# EAGLE schematic Schaltplan V1.0 (EAGLE 9.6.2)
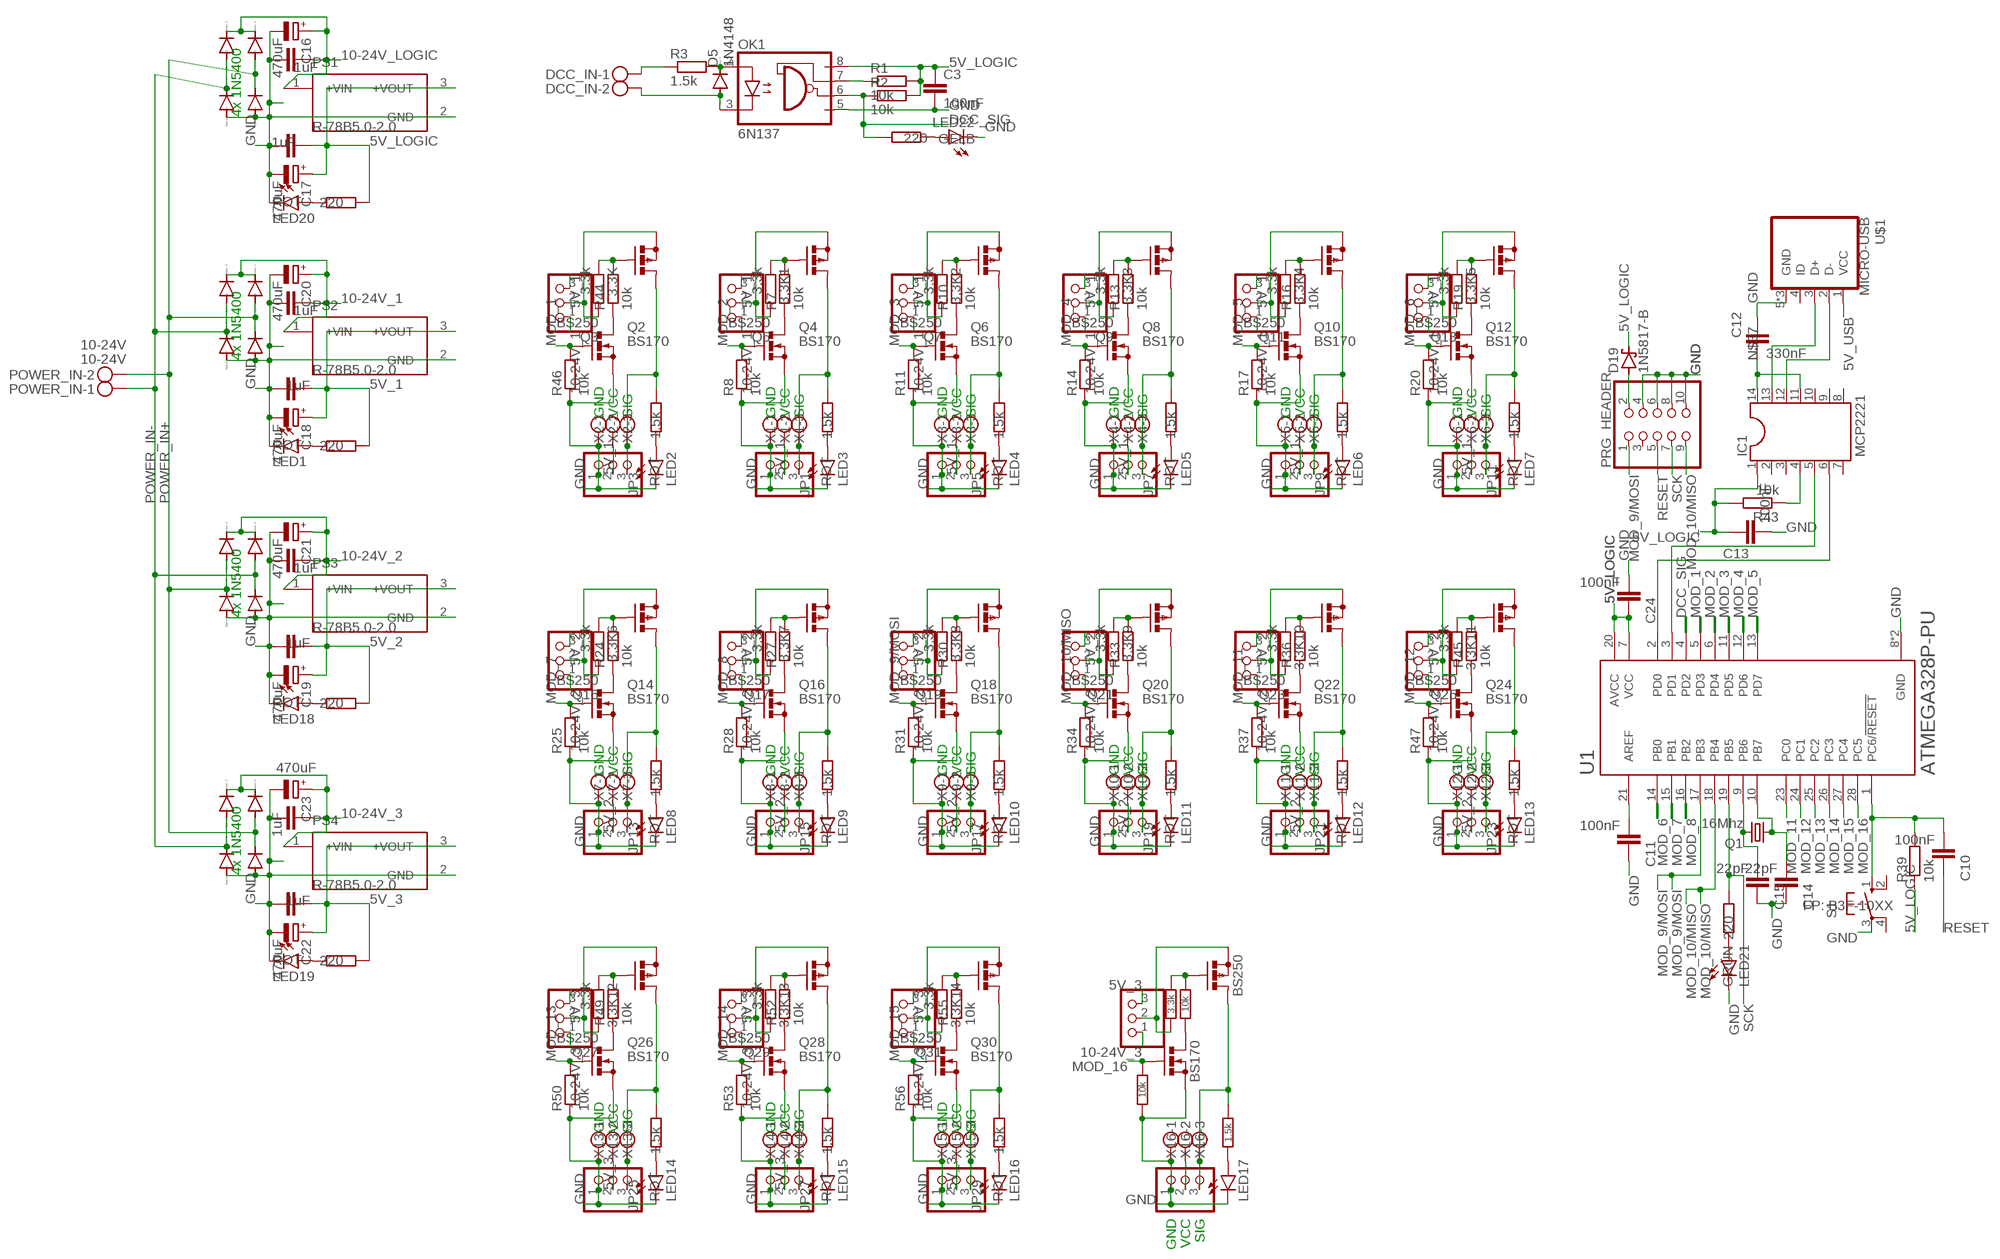
[diagram p0: schematic, sheet 1]

## Parts
3,3K  3.3k  R-EU_0207/7  [0207/7]
3,3K1  3.3k  R-EU_0207/7  [0207/7]
3,3K2  3.3k  R-EU_0207/7  [0207/7]
3,3K3  3.3k  R-EU_0207/7  [0207/7]
3,3K4  3.3k  R-EU_0207/7  [0207/7]
3,3K5  3.3k  R-EU_0207/7  [0207/7]
3,3K6  3.3k  R-EU_0207/7  [0207/7]
3,3K7  3.3k  R-EU_0207/7  [0207/7]
3,3K8  3.3k  R-EU_0207/7  [0207/7]
3,3K9  3.3k  R-EU_0207/7  [0207/7]
3,3K10  3.3k  R-EU_0207/7  [0207/7]
3,3K11  3.3k  R-EU_0207/7  [0207/7]
3,3K12  3.3k  R-EU_0207/7  [0207/7]
3,3K13  3.3k  R-EU_0207/7  [0207/7]
3,3K14  3.3k  R-EU_0207/7  [0207/7]
3,3K15  3.3k  R-EU_0207/7  [0207/7]
C1  1uF  C-EU050-025X075  [C050-025X075]
C2  1uF  C-EU050-025X075  [C050-025X075]
C3  100nF  C-EU025-025X050  [C025-025X050]
C4  1uF  C-EU050-025X075  [C050-025X075]
C5  1uF  C-EU050-025X075  [C050-025X075]
C6  1uF  C-EU050-025X075  [C050-025X075]
C7  1uF  C-EU050-025X075  [C050-025X075]
C8  1uF  C-EU050-025X075  [C050-025X075]
C9  1uF  C-EU050-025X075  [C050-025X075]
C10  100nF  C-EU025-025X050  [C025-025X050]
C11  100nF  C-EU025-025X050  [C025-025X050]
C12  330nF  C-EU025-025X050  [C025-025X050]
C13  100nF  C-EU025-025X050  [C025-025X050]
C14  22pF  C-EU025-030X050  [C025-030X050]
C15  22pF  C-EU025-030X050  [C025-030X050]
C16  470uF  CPOL-EUE5-10.5  [E5-10,5]
C17  470uF  CPOL-EUE5-10.5  [E5-10,5]
C18  470uF  CPOL-EUE5-10.5  [E5-10,5]
C19  470uF  CPOL-EUE5-10.5  [E5-10,5]
C20  470uF  CPOL-EUE5-10.5  [E5-10,5]
C21  470uF  CPOL-EUE5-10.5  [E5-10,5]
C22  470uF  CPOL-EUE5-10.5  [E5-10,5]
C23  470uF  CPOL-EUE5-10.5  [E5-10,5]
C24  100nF  C-EU025-025X050  [C025-025X050]
D1  1N5400  [DO201-15]
D2  1N5400  [DO201-15]
D3  1N5400  [DO201-15]
D4  1N5400  [DO201-15]
D5  1N4148  1N4148DO35-7  [DO35-7]
D6  1N5400  [DO201-15]
D7  1N5400  [DO201-15]
D8  1N5400  [DO201-15]
D9  1N5400  [DO201-15]
D10  1N5400  [DO201-15]
D11  1N5400  [DO201-15]
D12  1N5400  [DO201-15]
D13  1N5400  [DO201-15]
D14  1N5400  [DO201-15]
D15  1N5400  [DO201-15]
D16  1N5400  [DO201-15]
D17  1N5400  [DO201-15]
D19  1N5817-B  [DO41-7.6]
DCC_IN  MKDSN1,5/2-5,08  [MKDSN1,5/2-5,08]
IC1  MCP2221  DIL14  [DIL14]
JP1  PINHD-1X3  [1X03]
JP2  PINHD-1X3  [1X03]
JP3  PINHD-1X3  [1X03]
JP4  PINHD-1X3  [1X03]
JP5  PINHD-1X3  [1X03]
JP6  PINHD-1X3  [1X03]
JP7  PINHD-1X3  [1X03]
JP8  PINHD-1X3  [1X03]
JP9  PINHD-1X3  [1X03]
JP10  PINHD-1X3  [1X03]
JP11  PINHD-1X3  [1X03]
JP12  PINHD-1X3  [1X03]
JP13  PINHD-1X3  [1X03]
JP14  PINHD-1X3  [1X03]
JP15  PINHD-1X3  [1X03]
JP16  PINHD-1X3  [1X03]
JP17  PINHD-1X3  [1X03]
JP18  PINHD-1X3  [1X03]
JP19  PINHD-1X3  [1X03]
JP20  PINHD-1X3  [1X03]
JP21  PINHD-1X3  [1X03]
JP22  PINHD-1X3  [1X03]
JP23  PINHD-1X3  [1X03]
JP24  PINHD-1X3  [1X03]
JP25  PINHD-1X3  [1X03]
JP26  PINHD-1X3  [1X03]
JP27  PINHD-1X3  [1X03]
JP28  PINHD-1X3  [1X03]
JP29  PINHD-1X3  [1X03]
JP30  PINHD-1X3  [1X03]
JP31  PINHD-1X3  [1X03]
JP32  PINHD-1X3  [1X03]
LED1  ROT  LED3MM  [LED3MM]
LED2  ROT  LED3MM  [LED3MM]
LED3  ROT  LED3MM  [LED3MM]
LED4  ROT  LED3MM  [LED3MM]
LED5  ROT  LED3MM  [LED3MM]
LED6  ROT  LED3MM  [LED3MM]
LED7  ROT  LED3MM  [LED3MM]
LED8  ROT  LED3MM  [LED3MM]
LED9  ROT  LED3MM  [LED3MM]
LED10  ROT  LED3MM  [LED3MM]
LED11  ROT  LED3MM  [LED3MM]
LED12  ROT  LED3MM  [LED3MM]
LED13  ROT  LED3MM  [LED3MM]
LED14  ROT  LED3MM  [LED3MM]
LED15  ROT  LED3MM  [LED3MM]
LED16  ROT  LED3MM  [LED3MM]
LED17  ROT  LED3MM  [LED3MM]
LED18  ROT  LED3MM  [LED3MM]
LED19  ROT  LED3MM  [LED3MM]
LED20  ROT  LED3MM  [LED3MM]
LED21  GRÜN  LED3MM  [LED3MM]
LED22  GELB  LED3MM  [LED3MM]
OK1  6N137  [DIL08]
POWER_IN  10-24V  MKDSN1,5/2-5,08  [MKDSN1,5/2-5,08]
PRG_HEADER  PINHD-2X5  [2X05]
PS1  R-78B5.0-2.0  [CONV_R-78B5.0-2.0]
PS2  R-78B5.0-2.0  [CONV_R-78B5.0-2.0]
PS3  R-78B5.0-2.0  [CONV_R-78B5.0-2.0]
PS4  R-78B5.0-2.0  [CONV_R-78B5.0-2.0]
Q1  16Mhz  CRYSTALHC49U-V  [HC49U-V]
Q2  BS170  [SOT54E]
Q3  BS250  [SOT54E]
Q4  BS170  [SOT54E]
Q5  BS250  [SOT54E]
Q6  BS170  [SOT54E]
Q7  BS250  [SOT54E]
Q8  BS170  [SOT54E]
Q9  BS250  [SOT54E]
Q10  BS170  [SOT54E]
Q11  BS250  [SOT54E]
Q12  BS170  [SOT54E]
Q13  BS250  [SOT54E]
Q14  BS170  [SOT54E]
Q15  BS250  [SOT54E]
Q16  BS170  [SOT54E]
Q17  BS250  [SOT54E]
Q18  BS170  [SOT54E]
Q19  BS250  [SOT54E]
Q20  BS170  [SOT54E]
Q21  BS250  [SOT54E]
Q22  BS170  [SOT54E]
Q23  BS250  [SOT54E]
Q24  BS170  [SOT54E]
Q25  BS250  [SOT54E]
Q26  BS170  [SOT54E]
Q27  BS250  [SOT54E]
Q28  BS170  [SOT54E]
Q29  BS250  [SOT54E]
Q30  BS170  [SOT54E]
Q31  BS250  [SOT54E]
Q32  BS170  [SOT54E]
Q33  BS250  [SOT54E]
R1  10k  R-EU_0207/7  [0207/7]
R2  10k  R-EU_0207/7  [0207/7]
R3  1.5k  R-EU_0207/7  [0207/7]
R4  220  R-EU_0207/7  [0207/7]
R5  1.5k  R-EU_0207/7  [0207/7]
R6  1.5k  R-EU_0207/7  [0207/7]
R7  10k  R-EU_0207/7  [0207/7]
R8  10k  R-EU_0207/7  [0207/7]
R9  1.5k  R-EU_0207/7  [0207/7]
R10  10k  R-EU_0207/7  [0207/7]
R11  10k  R-EU_0207/7  [0207/7]
R12  1.5k  R-EU_0207/7  [0207/7]
R13  10k  R-EU_0207/7  [0207/7]
R14  10k  R-EU_0207/7  [0207/7]
R15  1.5k  R-EU_0207/7  [0207/7]
R16  10k  R-EU_0207/7  [0207/7]
R17  10k  R-EU_0207/7  [0207/7]
R18  1.5k  R-EU_0207/7  [0207/7]
R19  10k  R-EU_0207/7  [0207/7]
R20  10k  R-EU_0207/7  [0207/7]
R21  220  R-EU_0207/7  [0207/7]
R22  220  R-EU_0207/7  [0207/7]
R23  1.5k  R-EU_0207/7  [0207/7]
R24  10k  R-EU_0207/7  [0207/7]
R25  10k  R-EU_0207/7  [0207/7]
R26  1.5k  R-EU_0207/7  [0207/7]
R27  10k  R-EU_0207/7  [0207/7]
R28  10k  R-EU_0207/7  [0207/7]
R29  1.5k  R-EU_0207/7  [0207/7]
R30  10k  R-EU_0207/7  [0207/7]
R31  10k  R-EU_0207/7  [0207/7]
R32  1.5k  R-EU_0207/7  [0207/7]
R33  10k  R-EU_0207/7  [0207/7]
R34  10k  R-EU_0207/7  [0207/7]
R35  1.5k  R-EU_0207/7  [0207/7]
R36  10k  R-EU_0207/7  [0207/7]
R37  10k  R-EU_0207/7  [0207/7]
R38  1.5k  R-EU_0207/7  [0207/7]
R39  10k  R-EU_0207/7  [0207/7]
R40  220  R-EU_0207/7  [0207/7]
R41  220  R-EU_0207/7  [0207/7]
R42  220  R-EU_0207/7  [0207/7]
R43  10k  R-EU_0207/7  [0207/7]
R44  10k  R-EU_0207/7  [0207/7]
R45  10k  R-EU_0207/7  [0207/7]
R46  10k  R-EU_0207/7  [0207/7]
R47  10k  R-EU_0207/7  [0207/7]
R48  1.5k  R-EU_0207/7  [0207/7]
R49  10k  R-EU_0207/7  [0207/7]
R50  10k  R-EU_0207/7  [0207/7]
R51  1.5k  R-EU_0207/7  [0207/7]
R52  10k  R-EU_0207/7  [0207/7]
R53  10k  R-EU_0207/7  [0207/7]
R54  1.5k  R-EU_0207/7  [0207/7]
R55  10k  R-EU_0207/7  [0207/7]
R56  10k  R-EU_0207/7  [0207/7]
R57  1.5k  R-EU_0207/7  [0207/7]
R58  10k  R-EU_0207/7  [0207/7]
R59  10k  R-EU_0207/7  [0207/7]
S1  FP: B3F-10XX  10-XX  [B3F-10XX]
U1  ATMEGA328P-PU  [DIP794W46P254L2967H457Q28B]
U$1  MICRO-USB  [MICRO-USB]
X1  MKDSN1,5/3-5,08  [MKDSN1,5/3-5,08]
X2  MKDSN1,5/3-5,08  [MKDSN1,5/3-5,08]
X3  MKDSN1,5/3-5,08  [MKDSN1,5/3-5,08]
X4  MKDSN1,5/3-5,08  [MKDSN1,5/3-5,08]
X5  MKDSN1,5/3-5,08  [MKDSN1,5/3-5,08]
X6  MKDSN1,5/3-5,08  [MKDSN1,5/3-5,08]
X7  MKDSN1,5/3-5,08  [MKDSN1,5/3-5,08]
X8  MKDSN1,5/3-5,08  [MKDSN1,5/3-5,08]
X9  MKDSN1,5/3-5,08  [MKDSN1,5/3-5,08]
X10  MKDSN1,5/3-5,08  [MKDSN1,5/3-5,08]
X11  MKDSN1,5/3-5,08  [MKDSN1,5/3-5,08]
X12  MKDSN1,5/3-5,08  [MKDSN1,5/3-5,08]
X13  MKDSN1,5/3-5,08  [MKDSN1,5/3-5,08]
X14  MKDSN1,5/3-5,08  [MKDSN1,5/3-5,08]
X15  MKDSN1,5/3-5,08  [MKDSN1,5/3-5,08]
X16  MKDSN1,5/3-5,08  [MKDSN1,5/3-5,08]

## Nets
5V_1: C1.2 C18.+ JP1.2 JP2.3 JP3.2 JP4.3 JP5.2 JP6.3 JP7.2 JP8.3 JP9.2 JP10.3 JP11.2 JP12.3 PS2.3(+VOUT) R4.2 X1.2 X2.2 X3.2 X4.2 X5.2 X6.2
5V_2: C4.2 C19.+ JP13.2 JP14.3 JP15.2 JP16.3 JP17.2 JP18.3 JP19.2 JP20.3 JP21.2 JP22.3 JP23.2 JP24.3 PS3.3(+VOUT) R21.2 X7.2 X8.2 X9.2 X10.2 X11.2 X12.2
5V_3: C6.2 C22.+ JP25.2 JP26.3 JP27.2 JP28.3 JP29.2 JP30.3 JP31.2 JP32.3 PS4.3(+VOUT) R22.2 X13.2 X14.2 X15.2 X16.2
5V_LOGIC: C3.1 C8.2 C13.1 C17.+ C24.1 D19.C IC1.1 OK1.8(VCC) PS1.3(+VOUT) R1.2 R2.2 R39.1 R40.2 R43.2 U1.7(VCC) U1.20(AVCC)
5V_USB: U$1.1(VCC)
10-24V_1: C2.2 C20.+ D1.C D3.C JP2.1 JP4.1 JP6.1 JP8.1 JP10.1 JP12.1 PS2.1(+VIN)
10-24V_2: C5.2 C21.+ D6.C D8.C JP14.1 JP16.1 JP18.1 JP20.1 JP22.1 JP24.1 PS3.1(+VIN)
10-24V_3: C7.2 C23.+ D10.C D12.C JP26.1 JP28.1 JP30.1 JP32.1 PS4.1(+VIN)
10-24V_LOGIC: C9.2 C16.+ D14.C D16.C PS1.1(+VIN)
AREF: C11.2 U1.21(AREF)
DCC_SIG: OK1.6(VO) R2.1 R42.2 U1.4(PD2)
GND: C1.1 C2.1 C3.2 C4.1 C5.1 C6.1 C7.1 C8.1 C9.1 C11.1 C12.1 C13.2 C14.1 C15.1 C16.- C17.- C18.- C19.- C20.- C21.- C22.- C23.- C24.2 D2.A D4.A D7.A D9.A D11.A D13.A D15.A D17.A JP1.1 JP3.1 JP5.1 JP7.1 JP9.1 JP11.1 JP13.1 JP15.1 JP17.1 JP19.1 JP21.1 JP23.1 JP25.1 JP27.1 JP29.1 JP31.1 LED1.K(C) LED2.K(C) LED3.K(C) LED4.K(C) LED5.K(C) LED6.K(C) LED7.K(C) LED8.K(C) LED9.K(C) LED10.K(C) LED11.K(C) LED12.K(C) LED13.K(C) LED14.K(C) LED15.K(C) LED16.K(C) LED17.K(C) LED18.K(C) LED19.K(C) LED20.K(C) LED21.K(C) LED22.K(C) OK1.5(GND) PRG_HEADER.4 PRG_HEADER.6 PRG_HEADER.8 PRG_HEADER.10 PS1.2(GND) PS2.2(GND) PS3.2(GND) PS4.2(GND) Q2.S Q4.S Q6.S Q8.S Q10.S Q12.S Q14.S Q16.S Q18.S Q20.S Q22.S Q24.S Q26.S Q28.S Q30.S Q32.S R8.1 R11.1 R14.1 R17.1 R20.1 R25.1 R28.1 R31.1 R34.1 R37.1 R46.1 R47.1 R50.1 R53.1 R56.1 R59.1 S1.3(P) U1.8(GND) U1.22(GND) U$1.5(GND) U$1.GND1(GND) U$1.GND2(GND) X1.1 X2.1 X3.1 X4.1 X5.1 X6.1 X7.1 X8.1 X9.1 X10.1 X11.1 X12.1 X13.1 X14.1 X15.1 X16.1
MOD_1: Q2.G R46.2 U1.5(PD3)
MOD_2: Q4.G R8.2 U1.6(PD4)
MOD_3: Q6.G R11.2 U1.11(PD5)
MOD_4: Q8.G R14.2 U1.12(PD6)
MOD_5: Q10.G R17.2 U1.13(PD7)
MOD_6: Q12.G R20.2 U1.14(PB0)
MOD_7: Q14.G R25.2 U1.15(PB1)
MOD_8: Q16.G R28.2 U1.16(PB2)
MOD_9/MOSI: PRG_HEADER.1 Q18.G R31.2 U1.17(PB3)
MOD_10/MISO: PRG_HEADER.9 Q20.G R34.2 U1.18(PB4)
MOD_11: Q22.G R37.2 U1.23(PC0)
MOD_12: Q24.G R47.2 U1.24(PC1)
MOD_13: Q26.G R50.2 U1.25(PC2)
MOD_14: Q28.G R53.2 U1.26(PC3)
MOD_15: Q30.G R56.2 U1.27(PC4)
MOD_16: Q32.G R59.2 U1.28(PC5)
N$1: DCC_IN.1 R3.1
N$2: LED1.A R4.1
N$3: LED18.A R21.1
N$4: D5.C OK1.2(A) R3.2
N$5: JP3.3 Q3.D R5.2 X2.3
N$6: JP1.3 Q5.D R6.2 X1.3
N$7: LED19.A R22.1
N$8: OK1.7(VE) R1.1
N$10: 3,3K13.1 Q29.G R52.2
N$13: LED20.A R40.1
N$14: LED3.A R6.1
N$15: 3,3K.2 JP4.2 Q3.S
N$16: LED2.A R5.1
N$17: LED21.A R41.1
N$18: 3,3K12.1 Q27.G R49.2
N$19: Q4.D R7.1
N$20: LED22.A R42.1
N$21: 3,3K1.2 JP2.2 Q5.S
N$22: JP5.3 Q7.D R9.2 X3.3
N$23: LED4.A R9.1
N$24: IC1.5 U1.3(PD1)
N$25: Q2.D R44.1
N$26: IC1.4 R43.1
N$27: IC1.13 U$1.3(D+)
N$28: 3,3K14.1 Q31.G R55.2
N$29: Q6.D R10.1
N$30: 3,3K2.2 JP6.2 Q7.S
N$31: JP7.3 Q9.D R12.2 X4.3
N$32: IC1.6 U1.2(PD0)
N$33: IC1.12 U$1.2(D-)
N$34: LED5.A R12.1
N$35: 3,3K15.1 Q33.G R58.2
N$36: Q8.D R13.1
N$37: C12.2 IC1.11 IC1.14
N$38: D19.A PRG_HEADER.2
N$39: 3,3K3.2 JP8.2 Q9.S
N$40: JP9.3 Q11.D R15.2 X5.3
N$41: LED6.A R15.1
N$43: Q10.D R16.1
N$44: 3,3K4.2 JP10.2 Q11.S
N$45: JP11.3 Q13.D R18.2 X6.3
N$46: LED7.A R18.1
N$48: Q12.D R19.1
N$49: D5.A DCC_IN.2 OK1.3(C)
N$50: 3,3K5.2 JP12.2 Q13.S
N$51: JP13.3 Q15.D R23.2 X7.3
N$52: LED8.A R23.1
N$53: 3,3K5.1 Q13.G R19.2
N$54: Q14.D R24.1
N$55: 3,3K6.2 JP14.2 Q15.S
N$56: JP15.3 Q17.D R26.2 X8.3
N$57: LED9.A R26.1
N$58: 3,3K4.1 Q11.G R16.2
N$59: Q16.D R27.1
N$60: 3,3K7.2 JP16.2 Q17.S
N$61: JP17.3 Q19.D R29.2 X9.3
N$62: LED10.A R29.1
N$63: 3,3K3.1 Q9.G R13.2
N$64: Q18.D R30.1
N$65: 3,3K8.2 JP18.2 Q19.S
N$66: JP19.3 Q21.D R32.2 X10.3
N$67: LED11.A R32.1
N$68: 3,3K10.1 Q23.G R36.2
N$69: Q20.D R33.1
N$70: 3,3K9.2 JP20.2 Q21.S
N$71: JP21.3 Q23.D R35.2 X11.3
N$72: LED12.A R35.1
N$73: 3,3K2.1 Q7.G R10.2
N$74: Q22.D R36.1
N$75: 3,3K10.2 JP22.2 Q23.S
N$76: JP23.3 Q25.D R38.2 X12.3
N$77: LED13.A R38.1
N$78: 3,3K1.1 Q5.G R7.2
N$79: Q24.D R45.1
N$80: 3,3K11.2 JP24.2 Q25.S
N$81: JP25.3 Q27.D R48.2 X13.3
N$82: LED14.A R48.1
N$84: Q26.D R49.1
N$85: 3,3K12.2 JP26.2 Q27.S
N$86: JP27.3 Q29.D R51.2 X14.3
N$87: LED15.A R51.1
N$89: Q28.D R52.1
N$90: 3,3K13.2 JP28.2 Q29.S
N$91: JP29.3 Q31.D R54.2 X15.3
N$92: LED16.A R54.1
N$94: Q30.D R55.1
N$95: 3,3K14.2 JP30.2 Q31.S
N$96: JP31.3 Q33.D R57.2 X16.3
N$97: LED17.A R57.1
N$99: Q32.D R58.1
N$100: 3,3K15.2 JP32.2 Q33.S
N$101: 3,3K9.1 Q21.G R33.2
N$102: 3,3K11.1 Q25.G R45.2
N$103: 3,3K8.1 Q19.G R30.2
N$104: 3,3K7.1 Q17.G R27.2
N$105: 3,3K6.1 Q15.G R24.2
N$106: 3,3K.1 Q3.G R44.2
POWER_IN+: D3.A D4.C D6.A D7.C D12.A D13.C D16.A D17.C POWER_IN.2
POWER_IN-: D1.A D2.C D8.A D9.C D10.A D11.C D14.A D15.C POWER_IN.1
QUARTZ_1: C15.2 Q1.2 U1.9(PB6)
QUARTZ_2: C14.2 Q1.1 U1.10(PB7)
RESET: C10.1 PRG_HEADER.5
RESET_MC: C10.2 R39.2 S1.1(S) U1.1(PC6/!RESET)
SCK: PRG_HEADER.7 R41.2 U1.19(PB5)
Unconnected: IC1.2 IC1.3 IC1.7 IC1.8 IC1.9 IC1.10 PRG_HEADER.3 S1.2(S1) S1.4(P1) U$1.4(ID)

## Notes on the sheet
- 4x 1N5400
- 4x 1N5400
- GND | VCC | SIG | GND | VCC | SIG | GND | VCC | SIG | GND | VCC | SIG | GND | VCC | SIG | GND | VCC | SIG
- 4x 1N5400
- GND | VCC | SIG | GND | VCC | SIG | GND | VCC | SIG | GND | VCC | SIG | GND | VCC | SIG | GND | VCC | SIG
- 4x 1N5400
- GND | VCC | SIG | GND | VCC | SIG | GND | VCC | SIG
- GND | VCC | SIG

## Library data of the parts
3,3K 3,3K1-3,3K15 R1-R59 = rcl:R-EU_: RESISTOR, European symbol; SPICEPREFIX: R
C1-C15 C24 = rcl:C-EU: CAPACITOR, European symbol; SPICEPREFIX: C
C16-C23 = rcl:CPOL-EU: POLARIZED CAPACITOR, European symbol; SPICEPREFIX: C
D1-D4 D6-D17 = diode:1N5400: DIODE standard rectifier, 3 A, 50 V (Motorola)
D5 = diode:1N4148: DIODE high speed (Philips)
D19 = diode:1N581*: 1.0A SCHOTTKY BARRIER RECTIFIER Source: http://www.diodes.com/datasheets/ds23001.pdf
DCC_IN POWER_IN = con-phoenix-508:MKDSN1,5/2-5,08: MKDSN 1,5/ 2-5,08 Printklemme Nennstrom: 13,5 A Nennspannung: 250 V Rastermaß: 5,08 mm Polzahl: 2 Anschlussart: Schraubanschluss Montage: Löten Anschlussrichtung Leiter/Platine: 0 ° Artikelnummer: 1729128 Source: http://eshop.phoenixcontact.com .. 1729128.pdf
IC1 = ic-package:DIL14: Dual In Line / Socket
JP1-JP32 = pinhead:PINHD-1X3: PIN HEADER
LED1-LED22 = led:LED: LED OSRAM: - CHIPLED LG R971, LG N971, LY N971, LG Q971, LY Q971, LO R971, LY R971 LH N974, LH R974 LS Q976, LO Q976, LY Q976 LO Q996 - Hyper CHIPLED LW Q18S LB Q993, LB Q99A, LB R99A - SideLED LS A670, LO A670, LY A670, LG A670, LP A670 LB A673, LV A673, LT A673, LW A673 LH A674 LY A675 LS A676, LA A676, LO A676, LY A676, LW A676 LS A679, LY A679, LG A679 - Hyper Micro SIDELED® LS Y876, LA Y876, LO Y876, LY Y876 LT Y87S - SmartLED LW L88C, LW L88S LB L89C, LB L89S, LG L890 LS L89K, LO L89K, LY L89K LS L896, LA L896, LO L896, LY L896 - TOPLED LS T670, LO T670, LY T670, LG T670, LP T670 LSG T670, LSP T670, LSY T670, LOP T670, LYG T670 LG T671, LOG T671, LSG T671 LB T673, LV T673, LT T673, LW T673 LH T674 LS T676, LA T676, LO T676, LY T676, LB T676, LH T676, LSB T676, LW T676 LB T67C, LV T67C, LT T67C, LS T67K, LO T67K, LY T67K, LW E67C LS E67B, LA E67B, LO E67B, LY E67B, LB E67C, LV E67C, LT E67C LW T67C LS T679, LY T679, LG T679 LS T770, LO T770, LY T770, LG T770, LP T770 LB T773, LV T773, LT T773, LW T773 LH T774 LS E675, LA E675, LY E675, LS T675 LS T776, LA T776, LO T776, LY T776, LB T776 LHGB T686 LT T68C, LB T68C - Hyper Mini TOPLED® LB M676 - Mini TOPLED Santana® LG M470 LS M47K, LO M47K, LY M47K Source: http://www.osram.convergy.de LUXEON: - LUMILED® LXK2-PW12-R00, LXK2-PW12-S00, LXK2-PW14-U00, LXK2-PW14-V00 LXK2-PM12-R00, LXK2-PM12-S00, LXK2-PM14-U00 LXK2-PE12-Q00, LXK2-PE12-R00, LXK2-PE12-S00, LXK2-PE14-T00, LXK2-PE14-U00 LXK2-PB12-K00, LXK2-PB12-L00, LXK2-PB12-M00, LXK2-PB14-N00, LXK2-PB14-P00, LXK2-PB14-Q00 LXK2-PR12-L00, LXK2-PR12-M00, LXK2-PR14-Q00, LXK2-PR14-R00 LXK2-PD12-Q00, LXK2-PD12-R00, LXK2-PD12-S00 LXK2-PH12-R00, LXK2-PH12-S00 LXK2-PL12-P00, LXK2-PL12-Q00, LXK2-PL12-R00 Source: www.luxeon.com KINGBRIGHT: KA-3528ASYC Source: www.kingbright.com
OK1 = optocoupler:6N137: MOTOROLA OPTO COUPLER; MPN: 6N137; OC_FARNELL: 1328376; OC_NEWARK: 52M1895
PRG_HEADER = pinhead:PINHD-2X5: PIN HEADER
PS1-PS4 = R-78B5.0-2.0:R-78B5.0-2.0: 2.0 Amp SIP3 Single Output Check availability <https://pricing.snapeda.com/parts/R-78B5.0-2.0/Recom%20Power/view-part?ref=eda>; AVAILABILITY: In Stock; DESCRIPTION: 2A DC/DC-Converter 'INNOLINE' SIP3 reg; MF: Recom Power; MP: R-78B5.0-2.0; PACKAGE: SIP-3 Recom Power; PRICE: None; PURCHASE-URL: https://pricing.snapeda.com/search/part/R-78B5.0-2.0/?ref=eda
Q1 = crystal:CRYSTAL: CRYSTAL; OC_FARNELL: 1666969; OC_NEWARK: unknown
Q2 Q4 Q6 Q8 Q10 Q12 Q14 Q16 Q18 Q20 Q22 Q24 Q26 Q28 Q30 Q32 = transistor-small-signal:BS170: N-CHANNEL MOS FET
Q3 Q5 Q7 Q9 Q11 Q13 Q15 Q17 Q19 Q21 Q23 Q25 Q27 Q29 Q31 Q33 = transistor-small-signal:BS250: P-CHANNEL MOS FET
S1 = switch-omron:10-XX: OMRON SWITCH; MPN: B3F-1000; OC_FARNELL: 176432; OC_NEWARK: 36M3542
U1 = ATMEGA328P-PU:ATMEGA328P-PU: ATmega Series 20 MHz 32 KB Flash 2 KB SRAM 8-Bit Microcontroller - DIP-28 Check availability <https://pricing.snapeda.com/parts/ATMEGA328P-PU/Microchip/view-part?ref=eda>; AVAILABILITY: In Stock; DESCRIPTION: AVR AVR® ATmega Microcontroller IC 8-Bit 20MHz 32KB (16K x 16) FLASH 28-PDIP; MF: Microchip; MP: ATMEGA328P-PU; PACKAGE: PDIP-28 Microchip; PRICE: None; PURCHASE-URL: https://pricing.snapeda.com/search/part/ATMEGA328P-PU/?ref=eda
U$1 = microusb:MICRO-USB: Micro USB B connector
X1-X16 = con-phoenix-508:MKDSN1,5/3-5,08: MKDSN 1,5/ 3-5,08 Printklemme Nennstrom: 13,5 A Nennspannung: 250 V Rastermaß: 5,08 mm Polzahl: 3 Anschlussart: Schraubanschluss Montage: Löten Anschlussrichtung Leiter/Platine: 0 ° Artikelnummer: 1729131 Source: http://eshop.phoenixcontact.com .. 1729131.pdf